# Altium schematic sheet CUK_3Ph_Analog_Isolation.SchDoc
size A3
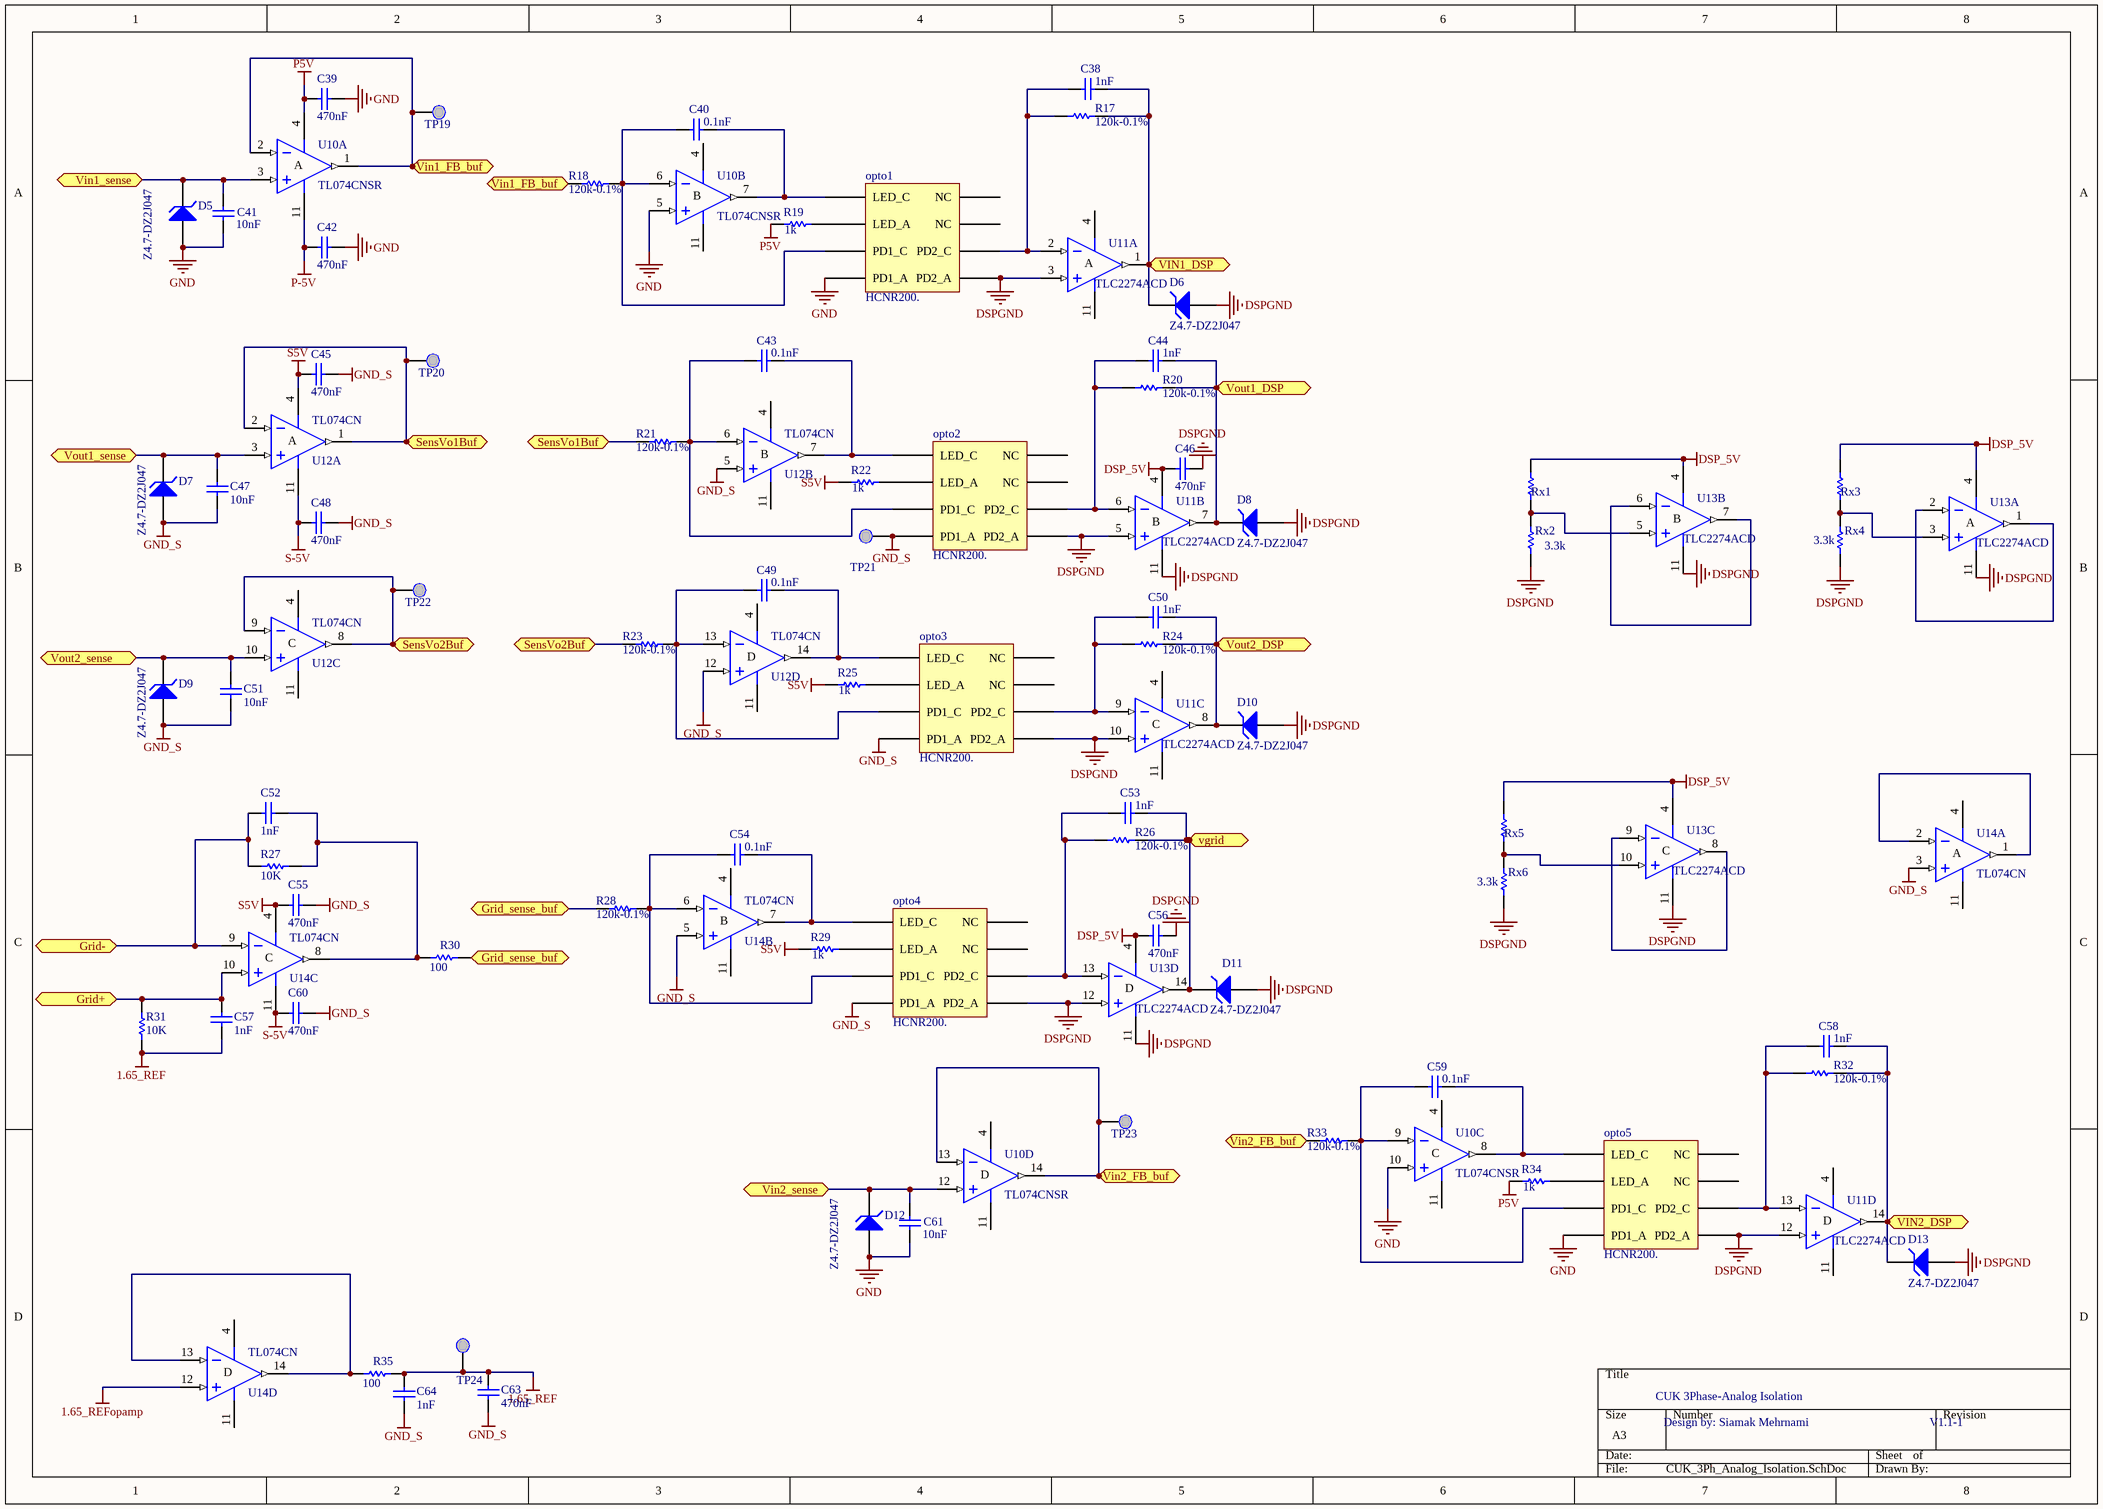
[diagram p0: CUK_3Ph_Analog_Isolation.SchDoc]

## Parts
C38  value 1nF  [Capacitor 0805]  (hidden comment: Cap)
C39  value 470nF  [Capacitor 0805]  (hidden comment: Cap)
C40  value 0.1nF  [Capacitor 0805]  (hidden comment: Cap)
C41  value 10nF  [Capacitor 0805]  (hidden comment: Cap)
C42  value 470nF  [Capacitor 0805]  (hidden comment: Cap)
C43  value 0.1nF  [Capacitor 0805]  (hidden comment: Cap)
C44  value 1nF  [Capacitor 0805]  (hidden comment: Cap)
C45  value 470nF  [Capacitor 0805]  (hidden comment: Cap)
C46  value 470nF  [Capacitor 0805]  (hidden comment: Cap)
C47  value 10nF  [Capacitor 0805]  (hidden comment: Cap)
C48  value 470nF  [Capacitor 0805]  (hidden comment: Cap)
C49  value 0.1nF  [Capacitor 0805]  (hidden comment: Cap)
C50  value 1nF  [Capacitor 0805]  (hidden comment: Cap)
C51  value 10nF  [Capacitor 0805]  (hidden comment: Cap)
C52  value 1nF  [Capacitor 0805]  (hidden comment: Cap)
C53  value 1nF  [Capacitor 0805]  (hidden comment: Cap)
C54  value 0.1nF  [Capacitor 0805]  (hidden comment: Cap)
C55  value 470nF  [Capacitor 0805]  (hidden comment: Cap)
C56  value 470nF  [Capacitor 0805]  (hidden comment: Cap)
C57  value 1nF  [Capacitor 0805]  (hidden comment: Cap)
C58  value 1nF  [Capacitor 0805]  (hidden comment: Cap)
C59  value 0.1nF  [Capacitor 0805]  (hidden comment: Cap)
C60  value 470nF  [Capacitor 0805]  (hidden comment: Cap)
C61  value 10nF  [Capacitor 0805]  (hidden comment: Cap)
C63  value 470nF  [Capacitor 0805]  (hidden comment: Cap)
C64  value 1nF  [Capacitor 0805]  (hidden comment: Cap)
D5  Z4.7-DZ2J047  [Zener DZ2J047]
D6  Z4.7-DZ2J047  [Zener DZ2J047]
D7  Z4.7-DZ2J047  [Zener DZ2J047]
D8  Z4.7-DZ2J047  [Zener DZ2J047]
D9  Z4.7-DZ2J047  [Zener DZ2J047]
D10  Z4.7-DZ2J047  [Zener DZ2J047]
D11  Z4.7-DZ2J047  [Zener DZ2J047]
D12  Z4.7-DZ2J047  [Zener DZ2J047]
D13  Z4.7-DZ2J047  [Zener DZ2J047]
opto1  HCNR200.  [HCNR200]
opto2  HCNR200.  [HCNR200]
opto3  HCNR200.  [HCNR200]
opto4  HCNR200.  [HCNR200]
opto5  HCNR200.  [HCNR200]
R17  value 120k-0.1%  [0805 RES]  (hidden comment: Res1)
R18  value 120k-0.1%  [0805 RES]  (hidden comment: Res1)
R19  value 1k  [0805 RES]  (hidden comment: Res1)
R20  value 120k-0.1%  [0805 RES]  (hidden comment: Res1)
R21  value 120k-0.1%  [0805 RES]  (hidden comment: Res1)
R22  value 1k  [0805 RES]  (hidden comment: Res1)
R23  value 120k-0.1%  [0805 RES]  (hidden comment: Res1)
R24  value 120k-0.1%  [0805 RES]  (hidden comment: Res1)
R25  value 1k  [0805 RES]  (hidden comment: Res1)
R26  value 120k-0.1%  [0805 RES]  (hidden comment: Res1)
R27  value 10K  [0805 RES]  (hidden comment: Res1)
R28  value 120k-0.1%  [0805 RES]  (hidden comment: Res1)
R29  value 1k  [0805 RES]  (hidden comment: Res1)
R30  value 100  [0805 RES]  (hidden comment: Res1)
R31  value 10K  [0805 RES]  (hidden comment: Res1)
R32  value 120k-0.1%  [0805 RES]  (hidden comment: Res1)
R33  value 120k-0.1%  [0805 RES]  (hidden comment: Res1)
R34  value 1k  [0805 RES]  (hidden comment: Res1)
R35  value 100  [0805 RES]  (hidden comment: Res1)
Rx1  Res1  [0805 RES]  (value not drawn)
Rx2  value 3.3k  [0805 RES]  (hidden comment: Res1)
Rx3  Res1  [0805 RES]  (value not drawn)
Rx4  value 3.3k  [0805 RES]  (hidden comment: Res1)
Rx5  Res1  [0805 RES]  (value not drawn)
Rx6  value 3.3k  [0805 RES]  (hidden comment: Res1)
TP19  Test point  [Test Point]  (value not drawn)
TP20  Test point  [Test Point]  (value not drawn)
TP21  Test point  [Test Point]  (value not drawn)
TP22  Test point  [Test Point]  (value not drawn)
TP23  Test point  [Test Point]  (value not drawn)
TP24  Test point  [Test Point]  (value not drawn)
U10  TL074CNSR  [DIP14]  (parts A,B,C,D of 4)
U11  TLC2274ACD  [SOIC14]  (parts A,B,C,D of 4)
U12  TL074CN  [DIP14]  (parts A,B,C,D of 4)
U13  TLC2274ACD  [SOIC14]  (parts A,B,C,D of 4)
U14  TL074CN  [DIP14]  (parts A,B,C,D of 4)

## Ports
Grid+ (bidir), Grid- (bidir), Grid_sense_buf, SensVo1Buf, SensVo2Buf, vgrid, VIN1_DSP, Vin1_FB_buf, Vin1_sense, VIN2_DSP, Vin2_FB_buf, Vin2_sense, Vout1_DSP, Vout1_sense, Vout2_DSP, Vout2_sense

## Nets
1.65_REF: C57.2 C63.1 C64.1 R31.1 R35.1 TP24.1
1.65_REFopamp: U14.12(IN+)
DSP_5V: C46.2 C56.2 Rx1.2 Rx3.2 Rx5.2 U11.4(V+) U13.4(V+)
DSPGND: C46.1 C56.1 D6.1(A) D8.1(A) D10.1(A) D11.1(A) D13.1(A) opto1.5(PD2_A) opto2.5(PD2_A) opto3.5(PD2_A) opto4.5(PD2_A) opto5.5(PD2_A) Rx2.1 Rx4.1 Rx6.1 U11.3(IN+) U11.5(IN+) U11.10(IN+) U11.11(V-) U11.12(IN+) U13.11(V-) U13.12(IN+)
GND: C39.1 C41.2 C42.1 C61.2 D5.1(A) D12.1(A) opto1.4(PD1_A) opto5.4(PD1_A) U10.5(IN+) U10.10(IN+)
GND_S: C45.1 C47.2 C48.1 C51.2 C55.1 C60.1 C63.2 C64.2 D7.1(A) D9.1(A) opto2.4(PD1_A) opto3.4(PD1_A) opto4.4(PD1_A) TP21.1 U12.5(IN+) U12.12(IN+) U14.3(IN+) U14.5(IN+)
P5V: C39.2 R19.1 R34.1 U10.4(V+)
P-5V: C42.2 U10.11(V-)
S5V: C45.2 C55.2 R22.1 R25.1 R29.1 U12.4(V+) U14.4(V+)
S-5V: C48.2 C60.2 U12.11(V-) U14.11(V-)
Grid+: C57.1 R31.2 U14.10(IN+) ; port Grid+
Grid-: C52.1 R27.2 U14.9(IN-) ; port Grid-
Grid_sense_buf: R28.1 R30.1 ; port Grid_sense_buf
SensVo1Buf: R21.1 TP20.1 U12.1(OUT) U12.2(IN-) ; port SensVo1Buf
SensVo2Buf: R23.1 TP22.1 U12.8(OUT) U12.9(IN-) ; port SensVo2Buf
vgrid: C53.2 D11.2(K) R26.2 U13.14(OUT) ; port vgrid
VIN1_DSP: C38.2 D6.2(K) R17.2 U11.1(OUT) ; port VIN1_DSP
Vin1_FB_buf: R18.1 TP19.1 U10.1(OUT) U10.2(IN-) ; port Vin1_FB_buf
Vin1_sense: C41.1 D5.2(K) U10.3(IN+) ; port Vin1_sense
VIN2_DSP: C58.2 D13.2(K) R32.2 U11.14(OUT) ; port VIN2_DSP
Vin2_FB_buf: R33.1 TP23.1 U10.13(IN-) U10.14(OUT) ; port Vin2_FB_buf
Vin2_sense: C61.1 D12.2(K) U10.12(IN+) ; port Vin2_sense
Vout1_DSP: C44.2 D8.2(K) R20.2 U11.7(OUT) ; port Vout1_DSP
Vout1_sense: C47.1 D7.2(K) U12.3(IN+) ; port Vout1_sense
Vout2_DSP: C50.2 D10.2(K) R24.2 U11.8(OUT) ; port Vout2_DSP
Vout2_sense: C51.1 D9.2(K) U12.10(IN+) ; port Vout2_sense
NetC38_1: C38.1 opto1.6(PD2_C) R17.1 U11.2(IN-)
NetC40_1: C40.1 opto1.3(PD1_C) R18.2 U10.6(IN-)
NetC40_2: C40.2 opto1.1(LED_C) U10.7(OUT)
NetC43_1: C43.1 opto2.3(PD1_C) R21.2 U12.6(IN-)
NetC43_2: C43.2 opto2.1(LED_C) U12.7(OUT)
NetC44_1: C44.1 opto2.6(PD2_C) R20.1 U11.6(IN-)
NetC49_1: C49.1 opto3.3(PD1_C) R23.2 U12.13(IN-)
NetC49_2: C49.2 opto3.1(LED_C) U12.14(OUT)
NetC50_1: C50.1 opto3.6(PD2_C) R24.1 U11.9(IN-)
NetC52_2: C52.2 R27.1 R30.2 U14.8(OUT)
NetC53_1: C53.1 opto4.6(PD2_C) R26.1 U13.13(IN-)
NetC54_1: C54.1 opto4.3(PD1_C) R28.2 U14.6(IN-)
NetC54_2: C54.2 opto4.1(LED_C) U14.7(OUT)
NetC58_1: C58.1 opto5.6(PD2_C) R32.1 U11.13(IN-)
NetC59_1: C59.1 opto5.3(PD1_C) R33.2 U10.9(IN-)
NetC59_2: C59.2 opto5.1(LED_C) U10.8(OUT)
Netopto1_2: opto1.2(LED_A) R19.2
Netopto2_2: opto2.2(LED_A) R22.2
Netopto3_2: opto3.2(LED_A) R25.2
Netopto4_2: opto4.2(LED_A) R29.2
Netopto5_2: opto5.2(LED_A) R34.2
NetR35_2: R35.2 U14.13(IN-) U14.14(OUT)
NetRx1_1: Rx1.1 Rx2.2 U13.5(IN+)
NetRx3_1: Rx3.1 Rx4.2 U13.3(IN+)
NetRx5_1: Rx5.1 Rx6.2 U13.10(IN+)
NetU13_1: U13.1(OUT) U13.2(IN-)
NetU13_6: U13.6(IN-) U13.7(OUT)
NetU13_8: U13.8(OUT) U13.9(IN-)
NetU14_1: U14.1(OUT) U14.2(IN-)

Not connected (* = marked no-connect by the designer): opto1 7(NC) 8(NC); opto2 7(NC) 8(NC); opto3 7(NC) 8(NC); opto4 7(NC) 8(NC); opto5 7(NC) 8(NC)

## Notes on the sheet
- CUK 3Phase-Analog Isolation
- Design by: Siamak Mehrnami
- V1.1-1
- (in symbol TL074J, part A) A
- (in symbol TL074J, part B) B
- (in symbol TL074J, part C) C
- (in symbol TL074J, part D) D
- (in symbol TS27L4AMD, part A) A
- (in symbol TS27L4AMD, part B) B
- (in symbol TS27L4AMD, part C) C
- (in symbol TS27L4AMD, part D) D

## Library data of the parts
C38-C61 C63 C64 = Cap: Capacitor; Published: 8-Jun-2000; LatestRevisionDate: 17-Jul-2002; LatestRevisionNote: Re-released for DXP Platform.; PackageReference: RAD-0.3; Publisher: Altium Limited
D5-D13 = D Zener: Zener Diode; Published: 8-Jun-2000; LatestRevisionDate: 17-Jul-2002; LatestRevisionNote: Re-released for DXP Platform.; PackageReference: DIODE-0.7; Publisher: Altium Limited
opto1-opto5 = Component_1
R17-R35 Rx1-Rx6 = Res1: Resistor; Published: 8-Jun-2000; Publisher: Altium Limited
  R17-R35: LatestRevisionDate: 17-Jul-2002; LatestRevisionNote: Re-released for DXP Platform.; PackageReference: AXIAL-0.3
  Rx1-Rx6: Revision: July-2002: Re-released for DXP Platform.
U10 U12 U14 = TL074J: Low-Noise JFET-Input Operational Amplifier; Published: 16-Jan-2001; LatestRevisionDate: 04-Mar-2005; LatestRevisionNote: Stylized 3D Model Added.; DatasheetVersion: Aug-1996; PackageVersion: Jun-1999; PackageReference: J014; Publisher: Altium Limited; PackageDescription: DIP; 14 Leads; Row Spacing 7.62 mm; Pitch 2.54 mm; ComponentLink1Description: Manufacturer Link; ComponentLink1URL: http://www.ti.com/; ComponentLink2Description: Datasheet; ComponentLink2URL: http://www-s.ti.com/sc/ds/tl074.pdf
U11 U13 = TS27L4AMD: Very Low-Power CMOS Quad Operational Amplifier; Published: 24-Aug-2001; LatestRevisionDate: 13-Apr-2006; LatestRevisionNote: IPC-7351 Footprint Added.; DatasheetVersion: Nov-1998; PackageVersion: Sep-1998; PackageReference: SO14; Publisher: Altium Limited; PackageDescription: 14-Pin Small Outline Integrated Circuit 1.27 mm Pitch; Code_IPC: SOIC127P600-14; ComponentLink1Description: Manufacturer Link; ComponentLink1URL: http://www.st.com/; ComponentLink2Description: Datasheet; ComponentLink2URL: http://www.st.com/stonline/products/literature/ds/2305/ts27l4.pdf